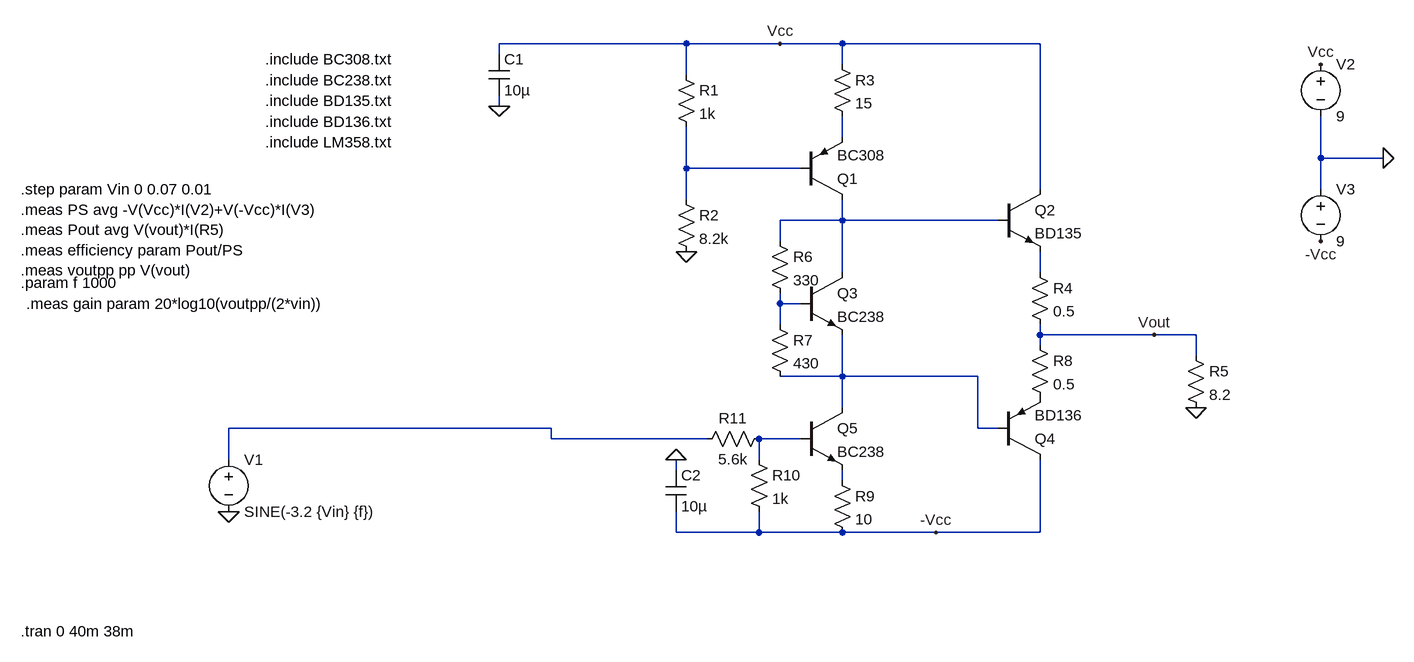
[diagram p0: schematic Lab3_test.asc]
Lab3_test.asc, the LTspice schematic file:
Version 4
SHEET 1 2020 920
WIRE 928 0 640 0
WIRE 1072 0 928 0
WIRE 1168 0 1072 0
WIRE 1472 0 1168 0
WIRE 640 16 640 0
WIRE 1168 32 1168 0
WIRE 928 48 928 0
WIRE 640 96 640 80
WIRE 1168 144 1168 112
WIRE 1904 176 1904 112
WIRE 2000 176 1904 176
WIRE 928 192 928 128
WIRE 1104 192 928 192
WIRE 1472 224 1472 0
WIRE 1904 224 1904 176
WIRE 928 240 928 192
WIRE 1168 272 1168 240
WIRE 1168 272 1072 272
WIRE 1408 272 1168 272
WIRE 1072 304 1072 272
WIRE 1168 352 1168 272
WIRE 1472 352 1472 320
WIRE 1072 400 1072 384
WIRE 1104 400 1072 400
WIRE 1072 432 1072 400
WIRE 1472 448 1472 432
WIRE 1648 448 1472 448
WIRE 1712 448 1648 448
WIRE 1472 464 1472 448
WIRE 1712 480 1712 448
WIRE 1168 512 1168 448
WIRE 1168 512 1072 512
WIRE 1376 512 1168 512
WIRE 1168 560 1168 512
WIRE 720 592 224 592
WIRE 1376 592 1376 512
WIRE 1408 592 1376 592
WIRE 720 608 720 592
WIRE 960 608 720 608
WIRE 1104 608 1040 608
WIRE 224 640 224 592
WIRE 1040 640 1040 608
WIRE 912 656 912 640
WIRE 1168 672 1168 656
WIRE 912 752 912 720
WIRE 1040 752 1040 720
WIRE 1040 752 912 752
WIRE 1168 752 1040 752
WIRE 1312 752 1168 752
WIRE 1472 752 1472 640
WIRE 1472 752 1312 752
FLAG 640 96 0
FLAG 928 320 0
FLAG 1712 560 0
FLAG 1648 448 Vout
FLAG 912 640 0
FLAG 224 720 0
FLAG 1072 0 Vcc
FLAG 1312 752 -Vcc
FLAG 2000 176 0
FLAG 1904 32 Vcc
FLAG 1904 304 -Vcc
SYMBOL cap 624 16 R0
SYMATTR InstName C1
SYMATTR Value 10µ
SYMBOL res 912 32 R0
SYMATTR InstName R1
SYMATTR Value 1k
SYMBOL res 912 224 R0
SYMATTR InstName R2
SYMATTR Value 8.2k
SYMBOL pnp 1104 240 M180
SYMATTR InstName Q1
SYMATTR Value BC308
SYMBOL res 1152 16 R0
SYMATTR InstName R3
SYMATTR Value 15
SYMBOL npn 1408 224 R0
SYMATTR InstName Q2
SYMATTR Value BD135
SYMBOL res 1456 336 R0
SYMATTR InstName R4
SYMATTR Value 0.5
SYMBOL res 1696 464 R0
SYMATTR InstName R5
SYMATTR Value 8.2
SYMBOL res 1056 288 R0
SYMATTR InstName R6
SYMATTR Value 330
SYMBOL res 1056 416 R0
SYMATTR InstName R7
SYMATTR Value 430
SYMBOL npn 1104 352 R0
SYMATTR InstName Q3
SYMATTR Value BC238
SYMBOL res 1456 448 R0
SYMATTR InstName R8
SYMATTR Value 0.5
SYMBOL pnp 1408 640 M180
SYMATTR InstName Q4
SYMATTR Value BD136
SYMBOL npn 1104 560 R0
SYMATTR InstName Q5
SYMATTR Value BC238
SYMBOL res 1152 656 R0
SYMATTR InstName R9
SYMATTR Value 10
SYMBOL res 1024 624 R0
SYMATTR InstName R10
SYMATTR Value 1k
SYMBOL cap 896 656 R0
SYMATTR InstName C2
SYMATTR Value 10µ
SYMBOL res 1056 592 R90
WINDOW 0 0 56 VBottom 2
WINDOW 3 32 56 VTop 2
SYMATTR InstName R11
SYMATTR Value 5.6k
SYMBOL voltage 224 624 R0
WINDOW 123 0 0 Left 0
WINDOW 39 0 0 Left 0
SYMATTR InstName V1
SYMATTR Value SINE(-3.2 {Vin} {f})
SYMBOL voltage 1904 16 R0
WINDOW 123 0 0 Left 0
WINDOW 39 0 0 Left 0
SYMATTR InstName V2
SYMATTR Value 9
SYMBOL voltage 1904 208 R0
WINDOW 123 0 0 Left 0
WINDOW 39 0 0 Left 0
SYMATTR InstName V3
SYMATTR Value 9
TEXT 280 152 Left 2 !.include LM358.txt
TEXT 280 120 Left 2 !.include BD136.txt
TEXT 280 88 Left 2 !.include BD135.txt
TEXT 280 56 Left 2 !.include BC238.txt
TEXT 280 24 Left 2 !.include BC308.txt
TEXT -96 224 Left 2 !.step param Vin 0 0.07 0.01\n.meas PS avg -V(Vcc)*I(V2)+V(-Vcc)*I(V3)\n.meas Pout avg V(vout)*I(R5)\n.meas efficiency param Pout/PS \n.meas voutpp pp V(vout)
TEXT -96 368 Left 2 !.param f 1000
TEXT -96 904 Left 2 !.tran 0 40m 38m
TEXT -88 400 Left 2 !.meas gain param 20*log10(voutpp/(2*vin))

The netlist it stands for:
* Lab3_test.asc
C1 Vcc 0 10µ
R1 Vcc N002 1k
R2 N002 0 8.2k
Q1 N003 N002 N001 0 BC308
R3 Vcc N001 15
Q2 Vcc N003 N004 0 BD135
R4 N004 Vout 0.5
R5 Vout 0 8.2
R6 N003 N005 330
R7 N005 N006 430
Q3 N003 N005 N006 0 BC238
R8 Vout P001 0.5
Q4 -Vcc N006 P001 0 BD136
Q5 N006 N008 N009 0 BC238
R9 N009 -Vcc 10
R10 N008 -Vcc 1k
C2 0 -Vcc 10µ
R11 N008 N007 5.6k
V1 N007 0 SINE(-3.2 {Vin} {f})
V2 Vcc 0 9
V3 0 -Vcc 9
.model NPN NPN
.model PNP PNP
.lib standard.bjt
.include LM358.txt
.include BD136.txt
.include BD135.txt
.include BC238.txt
.include BC308.txt
.step param Vin 0 0.07 0.01
.meas PS avg -V(Vcc)*I(V2)+V(-Vcc)*I(V3)
.meas Pout avg V(vout)*I(R5)
.meas efficiency param Pout/PS
.meas voutpp pp V(vout)
.param f 1000
.tran 0 40m 38m
.meas gain param 20*log10(voutpp/(2*vin))
.backanno
.end